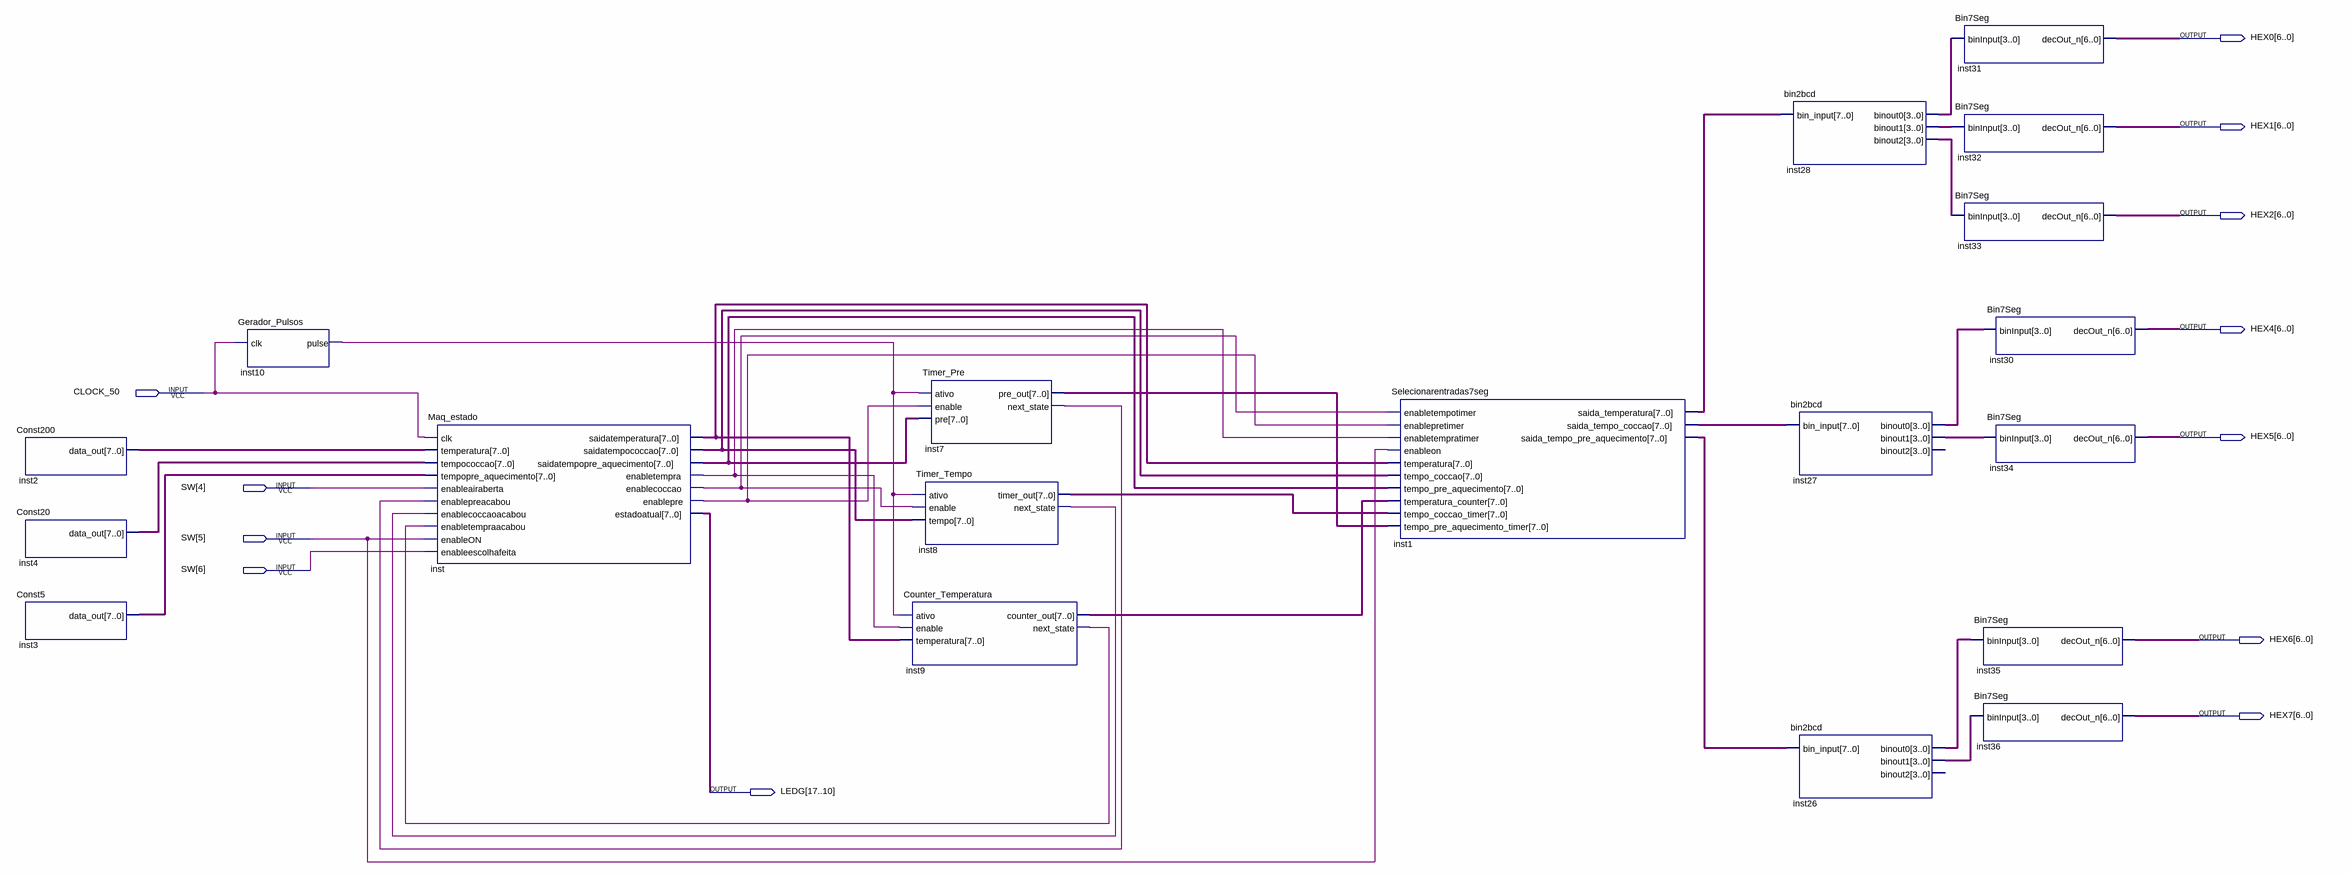
[diagram p0: schematic sheet]
// Quartus schematic tentativa3.bdf as structural Verilog: 19 symbols, 12 pins
module tentativa3 (
  input  CLOCK_50,
  input  [6:4] SW,
  output [6:0] HEX0,
  output [6:0] HEX1,
  output [6:0] HEX2,
  output [6:0] HEX4,
  output [6:0] HEX5,
  output [6:0] HEX6,
  output [6:0] HEX7,
  output [17:10] LEDG
);

  wire inst7_next_state, inst8_next_state, inst9_next_state, inst10_pulse, inst_enablecoccao, inst_enablepre,
       inst_enabletempra;
  wire [3:0] inst26_binout0, inst26_binout1, inst27_binout0, inst27_binout1, inst28_binout0, inst28_binout1,
       inst28_binout2;
  wire [7:0] inst1_saida_temperatura, inst1_saida_tempo_coccao, inst1_saida_tempo_pre_aquecimento,
       inst2_data_out, inst3_data_out, inst4_data_out, inst7_pre_out, inst8_timer_out, inst9_counter_out,
       inst_saidatemperatura, inst_saidatempococcao, inst_saidatempopre_aquecimento;

  Const200 inst2 (.data_out(inst2_data_out));
  Const20 inst4 (.data_out(inst4_data_out));
  Const5 inst3 (.data_out(inst3_data_out));
  Gerador_Pulsos inst10 (.clk(CLOCK_50), .pulse(inst10_pulse));
  Maq_estado inst (
    .clk(CLOCK_50), .temperatura(inst2_data_out), .tempococcao(inst4_data_out),
    .tempopre_aquecimento(inst3_data_out), .enableairaberta(SW[4]), .enablepreacabou(inst7_next_state),
    .enablecoccaoacabou(inst8_next_state), .enabletempraacabou(inst9_next_state), .enableON(SW[5]),
    .enableescolhafeita(SW[6]), .saidatemperatura(inst_saidatemperatura),
    .saidatempococcao(inst_saidatempococcao), .saidatempopre_aquecimento(inst_saidatempopre_aquecimento),
    .enabletempra(inst_enabletempra), .enablecoccao(inst_enablecoccao), .enablepre(inst_enablepre),
    .estadoatual(LEDG));
  Timer_Pre inst7 (
    .ativo(inst10_pulse), .enable(inst_enablepre), .pre(inst_saidatempopre_aquecimento),
    .pre_out(inst7_pre_out), .next_state(inst7_next_state));
  Timer_Tempo inst8 (
    .ativo(inst10_pulse), .enable(inst_enablecoccao), .tempo(inst_saidatempococcao),
    .timer_out(inst8_timer_out), .next_state(inst8_next_state));
  Counter_Temperatura inst9 (
    .ativo(inst10_pulse), .enable(inst_enabletempra), .temperatura(inst_saidatemperatura),
    .counter_out(inst9_counter_out), .next_state(inst9_next_state));
  Selecionarentradas7seg inst1 (
    .enabletempotimer(inst_enablecoccao), .enablepretimer(inst_enablepre),
    .enabletempratimer(inst_enabletempra), .enableon(SW[5]), .temperatura(inst_saidatemperatura),
    .tempo_coccao(inst_saidatempococcao), .tempo_pre_aquecimento(inst_saidatempopre_aquecimento),
    .temperatura_counter(inst9_counter_out), .tempo_coccao_timer(inst8_timer_out),
    .tempo_pre_aquecimento_timer(inst7_pre_out), .saida_temperatura(inst1_saida_temperatura),
    .saida_tempo_coccao(inst1_saida_tempo_coccao),
    .saida_tempo_pre_aquecimento(inst1_saida_tempo_pre_aquecimento));
  bin2bcd inst28 (
    .bin_input(inst1_saida_temperatura), .binout0(inst28_binout0), .binout1(inst28_binout1),
    .binout2(inst28_binout2));
  bin2bcd inst27 (
    .bin_input(inst1_saida_tempo_coccao), .binout0(inst27_binout0), .binout1(inst27_binout1));  // open: binout2
  bin2bcd inst26 (
    .bin_input(inst1_saida_tempo_pre_aquecimento), .binout0(inst26_binout0), .binout1(inst26_binout1));  // open: binout2
  Bin7Seg inst31 (.binInput(inst28_binout0), .decOut_n(HEX0));
  Bin7Seg inst32 (.binInput(inst28_binout1), .decOut_n(HEX1));
  Bin7Seg inst33 (.binInput(inst28_binout2), .decOut_n(HEX2));
  Bin7Seg inst30 (.binInput(inst27_binout0), .decOut_n(HEX4));
  Bin7Seg inst34 (.binInput(inst27_binout1), .decOut_n(HEX5));
  Bin7Seg inst35 (.binInput(inst26_binout0), .decOut_n(HEX6));
  Bin7Seg inst36 (.binInput(inst26_binout1), .decOut_n(HEX7));
endmodule
